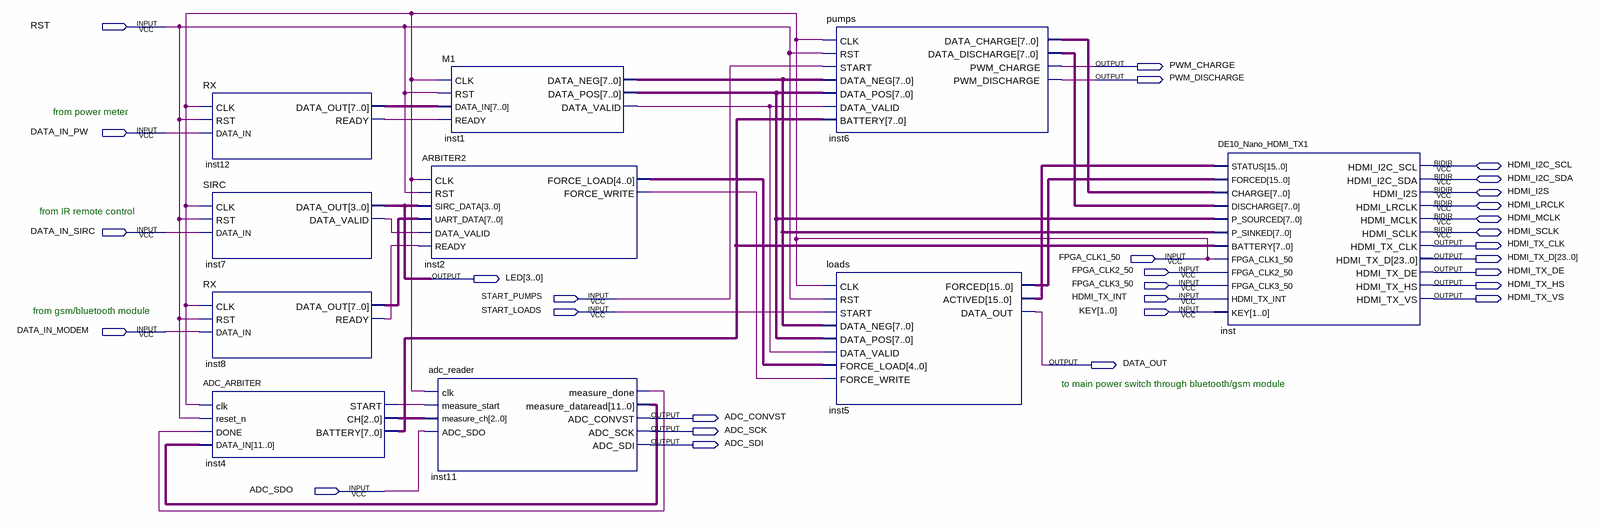
[diagram p0: schematic sheet]
// Quartus schematic DE10_Nano_HDMI_TX.bdf as structural Verilog: 10 symbols, 30 pins
module DE10_Nano_HDMI_TX (
  input  RST,
  input  DATA_IN_PW,
  input  DATA_IN_SIRC,
  input  FPGA_CLK1_50,
  input  FPGA_CLK2_50,
  input  FPGA_CLK3_50,
  input  START_PUMPS,
  input  HDMI_TX_INT,
  input  START_LOADS,
  input  [1:0] KEY,
  input  DATA_IN_MODEM,
  input  ADC_SDO,
  inout  HDMI_I2C_SCL,
  inout  HDMI_I2C_SDA,
  inout  HDMI_I2S,
  inout  HDMI_LRCLK,
  inout  HDMI_MCLK,
  inout  HDMI_SCLK,
  output PWM_CHARGE,
  output PWM_DISCHARGE,
  output HDMI_TX_CLK,
  output [23:0] HDMI_TX_D,
  output HDMI_TX_DE,
  output [3:0] LED,
  output HDMI_TX_HS,
  output HDMI_TX_VS,
  output DATA_OUT,
  output ADC_CONVST,
  output ADC_SCK,
  output ADC_SDI
);

  wire inst1_data_valid, inst2_force_write, inst4_start, inst7_data_valid, inst8_ready, inst11_measure_done,
       inst12_ready;
  wire [2:0] inst4_ch;
  wire [4:0] inst2_force_load;
  wire [7:0] inst1_data_neg, inst1_data_pos, inst4_battery, inst6_data_charge, inst6_data_discharge,
       inst8_data_out, inst12_data_out;
  wire [11:0] inst11_measure_dataread;
  wire [15:0] inst5_actived, inst5_forced;

  RX inst12 (.CLK(FPGA_CLK1_50), .RST(RST), .DATA_IN(DATA_IN_PW), .DATA_OUT(inst12_data_out), .READY(inst12_ready));
  SIRC inst7 (.CLK(FPGA_CLK1_50), .RST(RST), .DATA_IN(DATA_IN_SIRC), .DATA_OUT(LED), .DATA_VALID(inst7_data_valid));
  RX inst8 (.CLK(FPGA_CLK1_50), .RST(RST), .DATA_IN(DATA_IN_MODEM), .DATA_OUT(inst8_data_out), .READY(inst8_ready));
  ADC_ARBITER inst4 (
    .clk(FPGA_CLK1_50), .reset_n(RST), .DONE(inst11_measure_done), .DATA_IN(inst11_measure_dataread),
    .START(inst4_start), .CH(inst4_ch), .BATTERY(inst4_battery));
  ARBITER2 inst2 (
    .CLK(FPGA_CLK1_50), .RST(RST), .SIRC_DATA(LED), .UART_DATA(inst8_data_out),
    .DATA_VALID(inst7_data_valid), .READY(inst8_ready), .FORCE_LOAD(inst2_force_load),
    .FORCE_WRITE(inst2_force_write));
  adc_reader inst11 (
    .clk(FPGA_CLK1_50), .measure_start(inst4_start), .measure_ch(inst4_ch), .ADC_SDO(ADC_SDO),
    .measure_done(inst11_measure_done), .measure_dataread(inst11_measure_dataread), .ADC_CONVST(ADC_CONVST),
    .ADC_SCK(ADC_SCK), .ADC_SDI(ADC_SDI));
  M1 inst1 (
    .CLK(FPGA_CLK1_50), .RST(RST), .DATA_IN(inst12_data_out), .READY(inst12_ready),
    .DATA_NEG(inst1_data_neg), .DATA_POS(inst1_data_pos), .DATA_VALID(inst1_data_valid));
  pumps inst6 (
    .CLK(FPGA_CLK1_50), .RST(RST), .START(START_PUMPS), .DATA_NEG(inst1_data_neg), .DATA_POS(inst1_data_pos),
    .DATA_VALID(inst1_data_valid), .BATTERY(inst4_battery), .DATA_CHARGE(inst6_data_charge),
    .DATA_DISCHARGE(inst6_data_discharge), .PWM_CHARGE(PWM_CHARGE), .PWM_DISCHARGE(PWM_DISCHARGE));
  loads inst5 (
    .CLK(FPGA_CLK1_50), .RST(RST), .START(START_LOADS), .DATA_NEG(inst1_data_neg), .DATA_POS(inst1_data_pos),
    .DATA_VALID(inst1_data_valid), .FORCE_LOAD(inst2_force_load), .FORCE_WRITE(inst2_force_write),
    .FORCED(inst5_forced), .ACTIVED(inst5_actived), .DATA_OUT(DATA_OUT));
  DE10_Nano_HDMI_TX1 inst (
    .STATUS(inst5_actived), .FORCED(inst5_forced), .CHARGE(inst6_data_charge),
    .DISCHARGE(inst6_data_discharge), .P_SOURCED(inst1_data_pos), .P_SINKED(inst1_data_neg),
    .BATTERY(inst4_battery), .FPGA_CLK1_50(FPGA_CLK1_50), .FPGA_CLK2_50(FPGA_CLK2_50),
    .FPGA_CLK3_50(FPGA_CLK3_50), .HDMI_TX_INT(HDMI_TX_INT), .KEY(KEY), .HDMI_TX_CLK(HDMI_TX_CLK),
    .HDMI_TX_D(HDMI_TX_D), .HDMI_TX_DE(HDMI_TX_DE), .HDMI_TX_HS(HDMI_TX_HS), .HDMI_TX_VS(HDMI_TX_VS),
    .HDMI_I2C_SCL(HDMI_I2C_SCL), .HDMI_I2C_SDA(HDMI_I2C_SDA), .HDMI_I2S(HDMI_I2S), .HDMI_LRCLK(HDMI_LRCLK),
    .HDMI_MCLK(HDMI_MCLK), .HDMI_SCLK(HDMI_SCLK));

  // Notes on the sheet:
  //   from power meter
  //   from IR remote control
  //   from gsm/bluetooth module
  //   to main power switch through bluetooth/gsm module 
endmodule
